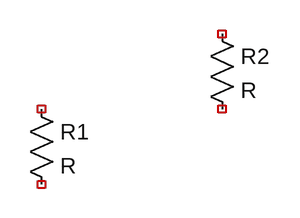
[diagram p0: schematic Acesso rápido.asc]
Acesso rápido.asc, the LTspice schematic file:
Version 4
SHEET 1 880 680
SYMBOL res 64 96 R0
SYMATTR InstName R1
SYMBOL res 256 16 R0
SYMATTR InstName R2

The netlist it stands for:
* Acesso rápido.asc
R1 NC_01 NC_02 R
R2 NC_03 NC_04 R
.backanno
.end